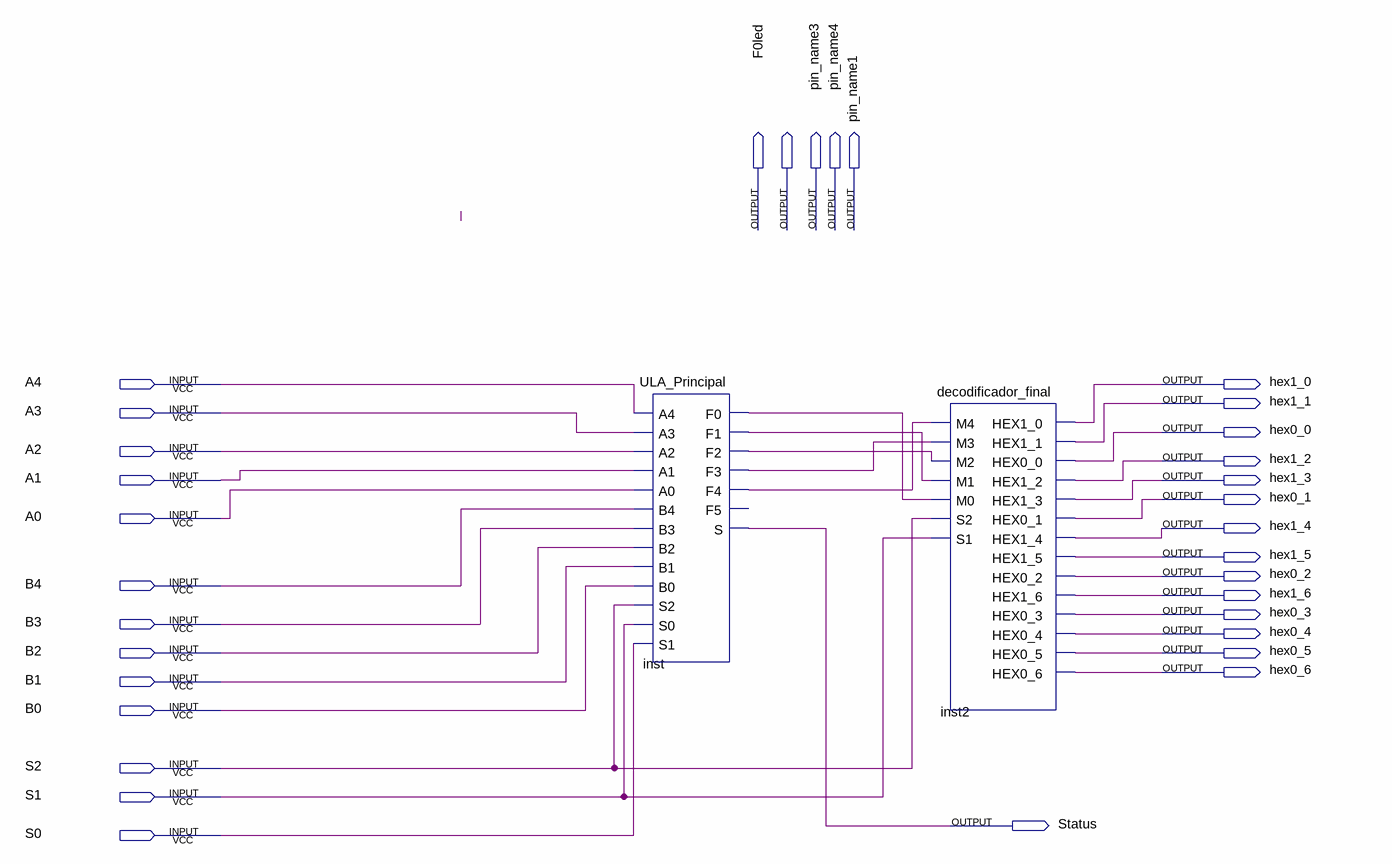
[diagram p0: schematic sheet]
// Quartus schematic CircuitoGeral2.bdf as structural Verilog: 2 symbols, 33 pins
module CircuitoGeral2 (
  input  A4,
  input  A3,
  input  A2,
  input  A1,
  input  A0,
  input  B4,
  input  B3,
  input  B2,
  input  B1,
  input  B0,
  input  S2,
  input  S1,
  input  S0,
  output F0led,
  output pin_name3,
  output pin_name4,
  output pin_name1,
  output hex1_0,
  output hex1_1,
  output hex0_0,
  output hex1_2,
  output hex1_3,
  output hex0_1,
  output hex1_4,
  output hex1_5,
  output hex0_2,
  output hex1_6,
  output hex0_3,
  output hex0_4,
  output hex0_5,
  output hex0_6,
  output Status
);

  wire inst_f0, inst_f1, inst_f2, inst_f3, inst_f4;

  ULA_Principal inst (
    .A4(A4), .A3(A3), .A2(A2), .A1(A1), .A0(A0), .B4(B4), .B3(B3), .B2(B2), .B1(B1), .B0(B0), .S2(S2),
    .S0(S1), .S1(S0), .F0(inst_f0), .F1(inst_f1), .F2(inst_f2), .F3(inst_f3), .F4(inst_f4), .S(Status));  // open: F5
  decodificador_final inst2 (
    .M4(inst_f4), .M3(inst_f3), .M2(inst_f2), .M1(inst_f1), .M0(inst_f0), .S2(S2), .S1(S1), .HEX1_0(hex1_0),
    .HEX1_1(hex1_1), .HEX0_0(hex0_0), .HEX1_2(hex1_2), .HEX1_3(hex1_3), .HEX0_1(hex0_1), .HEX1_4(hex1_4),
    .HEX1_5(hex1_5), .HEX0_2(hex0_2), .HEX1_6(hex1_6), .HEX0_3(hex0_3), .HEX0_4(hex0_4), .HEX0_5(hex0_5),
    .HEX0_6(hex0_6));
endmodule
